# Altium schematic sheet PT-100_Amplifier.SchDoc
size Letter; Organization: Altium Limited; Address1: L3, 12a Rodborough Rd; Address2: Frenchs Forest; Address3: NSW; Address4: Australia 2086
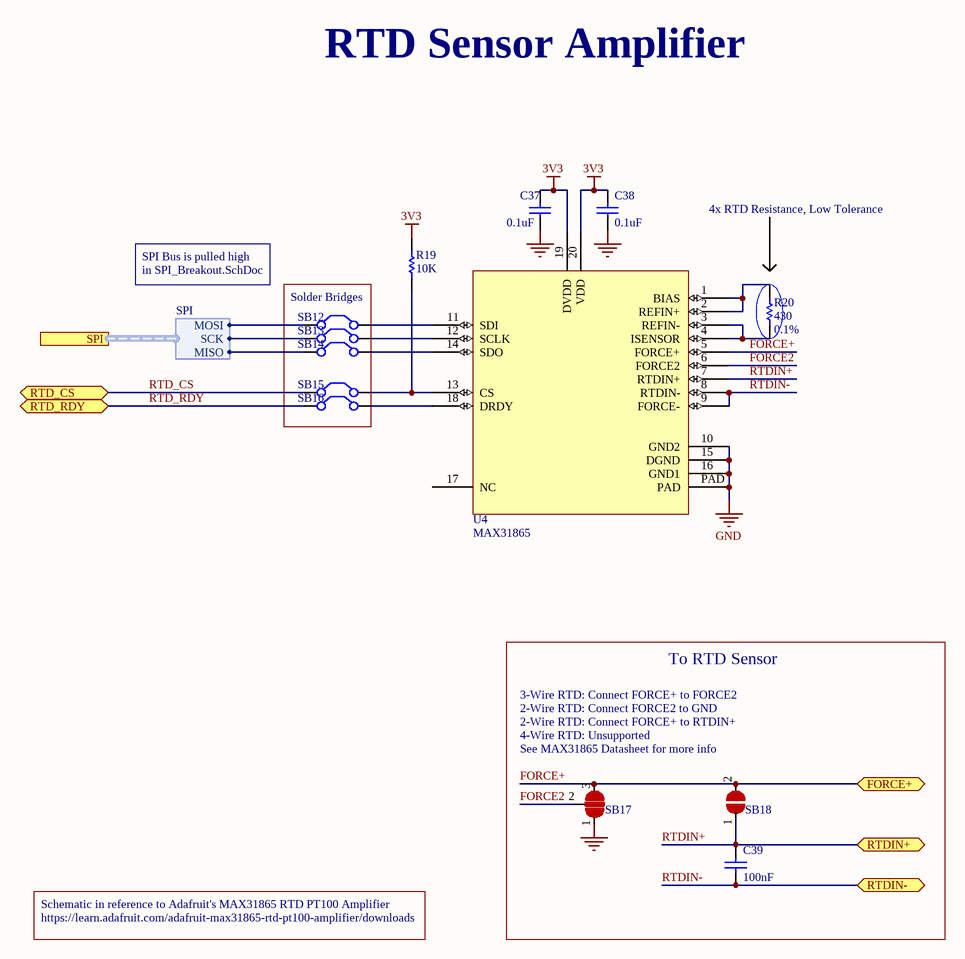
[diagram p0: PT-100_Amplifier.SchDoc]

## Parts
C37  value 0.1uF  [0402]  (hidden comment: Cap)
C38  value 0.1uF  [0402]  (hidden comment: Cap)
C39  value 100nF  [0402]  (hidden comment: Cap)
R19  value 10K  [0402]  (hidden comment: Res1)
R20  value 430  Tolerance: 0.1%  [0402]  (hidden comment: Res1)
SB12  Jumper  [SB-2pos]  (value not drawn)
SB13  Jumper  [SB-2pos]  (value not drawn)
SB14  Jumper  [SB-2pos]  (value not drawn)
SB15  Jumper  [SB-2pos]  (value not drawn)
SB16  Jumper  [SB-2pos]  (value not drawn)
SB17  Solder Jumper 3-Way  [SB-3pos]  (value not drawn)
SB18  Solder Jumper  [SB-2pos]  (value not drawn)
U4  MAX31865  [TQFN20-EP-Maxim]

## Blocks framed on the sheet
Solder Bridges: SB12-SB16
To RTD Sensor: C39 SB17 SB18

## Ports
FORCE+ (bidir), RTD_CS (bidir), RTD_RDY (bidir), RTDIN+ (bidir), RTDIN- (bidir), SPI (harness SPI)

## Harnesses
SPI: MISO, MOSI, SCK

## Nets
3V3: C37.2 C38.2 R19.1 U4.19(DVDD) U4.20(VDD)
GND: C37.1 C38.1 SB17.1 U4.10(GND2) U4.15(DGND) U4.16(GND1) U4.PAD
FORCE2: SB17.2 U4.6(FORCE2)
FORCE+: SB17.3 SB18.2 U4.5(FORCE+) ; port FORCE+
RTD_CS: SB15.1(C1) ; port RTD_CS
RTD_RDY: SB16.1(C1) ; port RTD_RDY
RTDIN+: C39.2 SB18.1 U4.7(RTDIN+) ; port RTDIN+
RTDIN-: C39.1 U4.8(RTDIN-) U4.9(FORCE-) ; port RTDIN-
NetR19_2: R19.2 SB15.2(C2) U4.13(CS)
NetR20_1: R20.1 U4.1(BIAS) U4.2(REFIN+)
NetR20_2: R20.2 U4.3(REFIN-) U4.4(ISENSOR)
NetSB12_1: SB12.1(C1) ; port SPI.MOSI
NetSB12_2: SB12.2(C2) U4.11(SDI)
NetSB13_1: SB13.1(C1) ; port SPI.SCK
NetSB13_2: SB13.2(C2) U4.12(SCLK)
NetSB14_1: SB14.1(C1) ; port SPI.MISO
NetSB14_2: SB14.2(C2) U4.14(SDO)
NetSB16_2: SB16.2(C2) U4.18(DRDY)

Not connected (* = marked no-connect by the designer): U4 17(NC)

## Notes on the sheet
- RTD Sensor Amplifier
- 4x RTD Resistance, Low Tolerance
- SPI Bus is pulled high
- in SPI_Breakout.SchDoc
- 3-Wire RTD: Connect FORCE+ to FORCE2
- 2-Wire RTD: Connect FORCE2 to GND
- 2-Wire RTD: Connect FORCE+ to RTDIN+
- (near SB17) 4-Wire RTD: Unsupported
- See MAX31865 Datasheet for more info
- https://learn.adafruit.com/adafruit-max31865-rtd-pt100-amplifier/downloads
- Schematic in reference to Adafruit's MAX31865 RTD PT100 Amplifier
- Title
- Size:
- Date:
- Letter
- Number:
- Time:
- Revision:
- Sheet
- of
- File:

## Library data of the parts
C37-C39 = Cap: Capacitor
R19 R20 = Res1: Resistor
SB12-SB16 = Jumper: Jumper Wire
U4 = MAX31865: RTD Digital Converter; Manufacturer Part Number: MAX31865ATP+; DigiKey Part Number: MAX31865ATP+-ND